# EAGLE design sht31 (EAGLE 7.7.0)
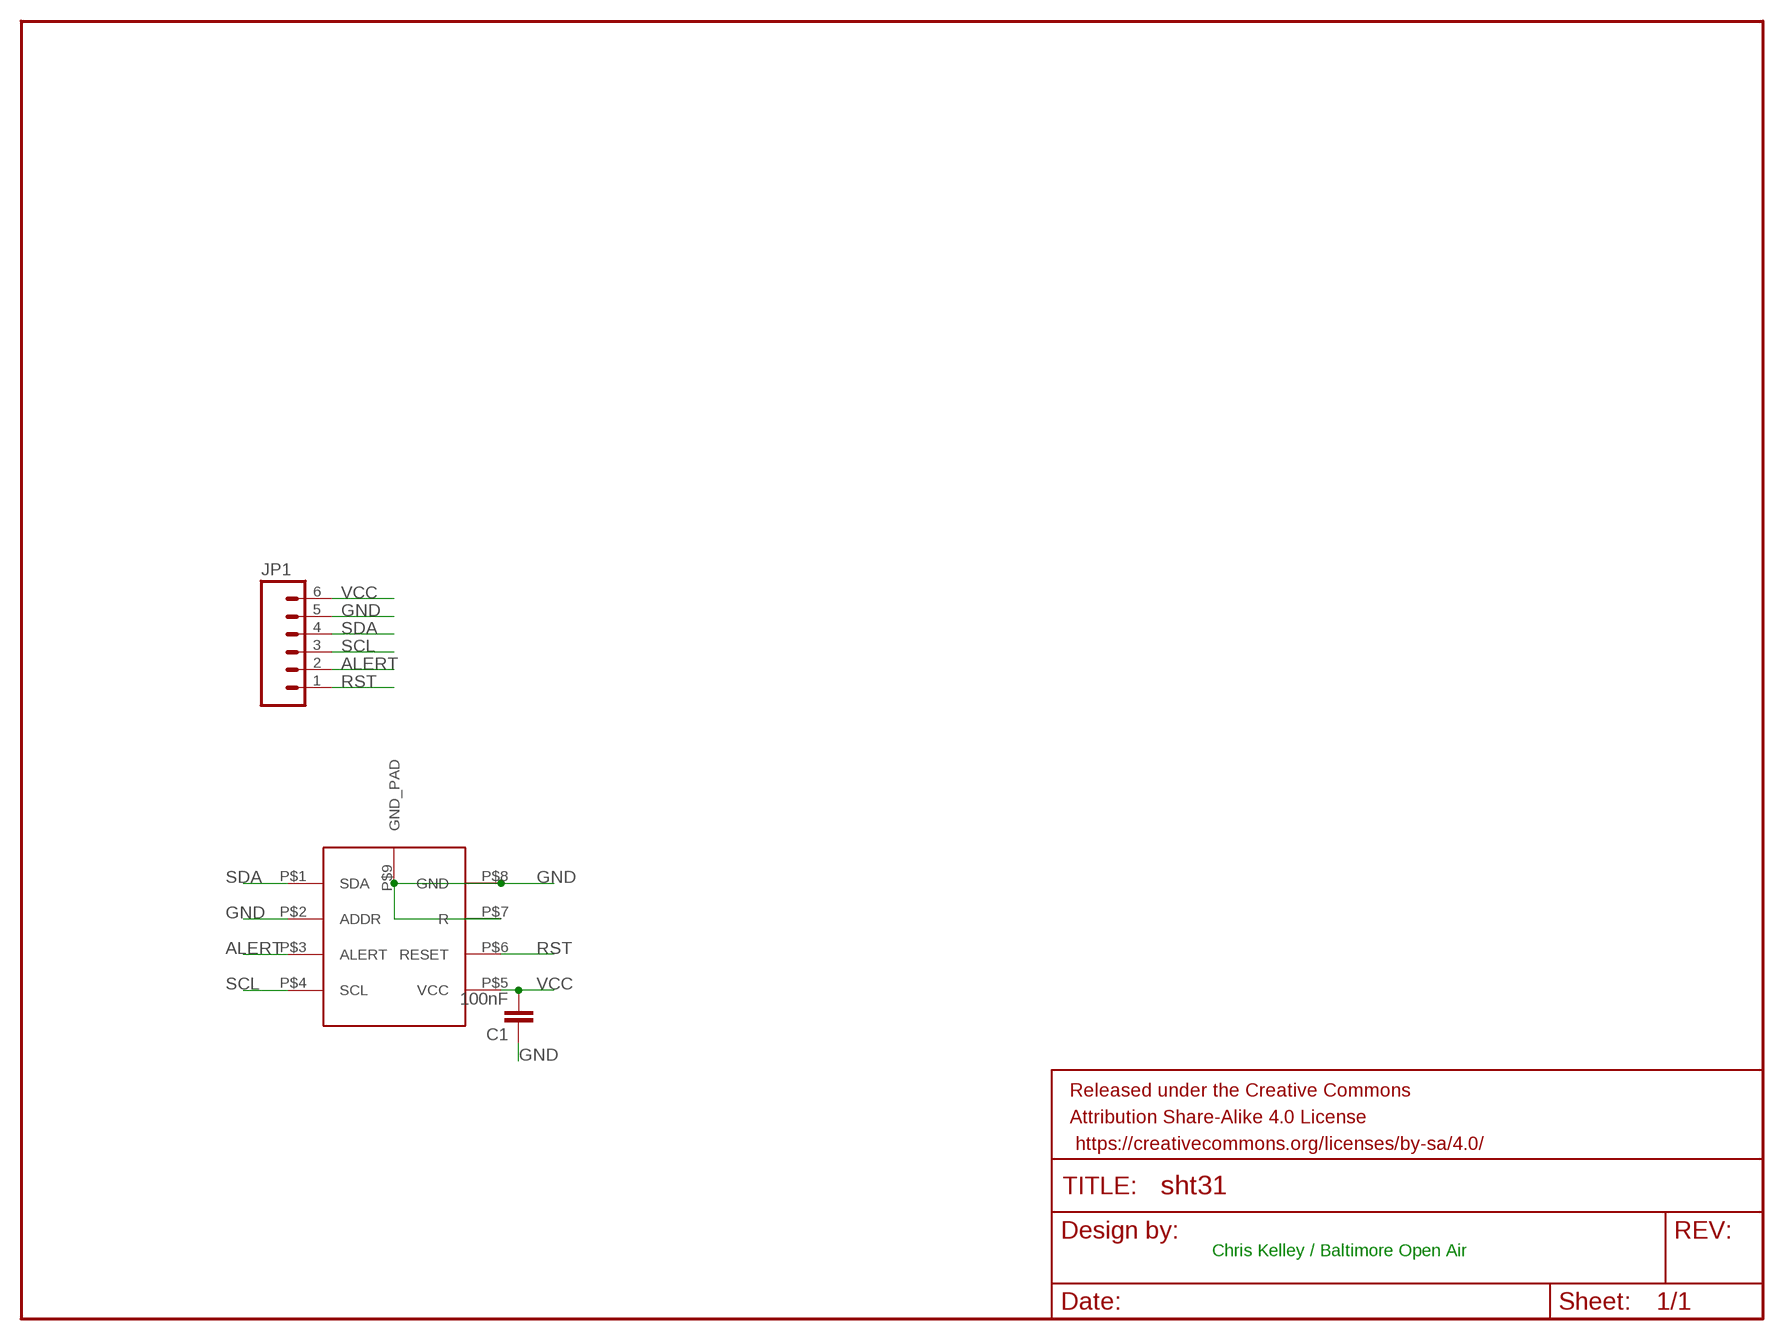
[diagram p0: schematic, sheet 1]

## Parts
C1  100nF  CAP0603-CAP  [0603-CAP]
FRAME1  FRAME-LETTER  [CREATIVE_COMMONS]
JP1  M06SILK_FEMALE_PTH  [1X06]
U$1  SHT31-D  [SHT31-D]

## Nets
ALERT: JP1.2 U$1.P$3(ALERT)
GND: C1.1 JP1.5 U$1.P$2(ADDR) U$1.P$7(R) U$1.P$8(GND) U$1.P$9(GND_PAD)
RST: JP1.1 U$1.P$6(RESET)
SCL: JP1.3 U$1.P$4(SCL)
SDA: JP1.4 U$1.P$1(SDA)
VCC: C1.2 JP1.6 U$1.P$5(VCC)

## Notes on the sheet
- Chris Kelley / Baltimore Open Air

## Library data of the parts
C1 = SparkFun-Passives:CAP: Capacitor Standard 0603 ceramic capacitor, and 0.1" leaded capacitor.
FRAME1 = SparkFun-Aesthetics:FRAME-LETTER: Schematic Frame Standard 8.5x11 US Letter frame
JP1 = SparkFun-Connectors:M06: Header 6 Standard 6-pin 0.1" header. Use with straight break away headers (SKU : PRT-00116), right angle break away headers (PRT-00553), swiss pins (PRT-00743), machine pins (PRT-00117), and female headers (PRT-00115). Molex polarized connector foot print use with SKU : PRT-08094 with associated crimp pins and housings. NOTES ON THE VARIANTS LOCK and LOCK_LONGPADS... This footprint was designed to help hold the alignment of a through-hole component (i.e. 6-pin header) while soldering it into place. You may notice that each hole has been shifted either up or down by 0.005 of an inch from it's more standard position (which is a perfectly straight line). This slight alteration caused the pins (the squares in the middle) to touch the edges of the holes. Because they are alternating, it causes a "brace" to hold the component in place. 0.005 has proven to be the perfect amount of "off-center" position when using our standard breakaway headers. Although looks a little odd when you look at the bare footprint, once you have a header in there, the alteration is very hard to notice. Also,if you push a header all the way into place, it is covered up entirely on the bottom side. This idea of altering the position of holes to aid alignment will be further integrated into the Sparkfun Library for other footprints. It can help hold any component with 3 or more connection pins.; PROD_ID: CONN-08437
U$1 = awqua_eagle_library:SHT31-D

## Board
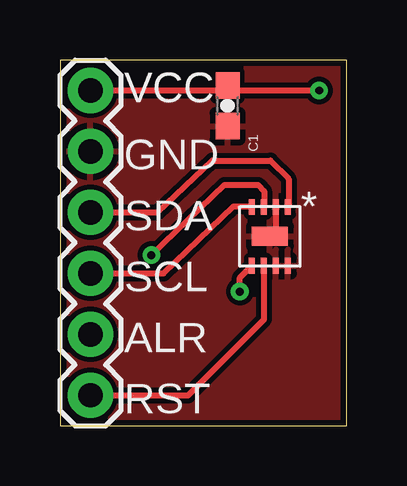
[diagram p1: board, top side]
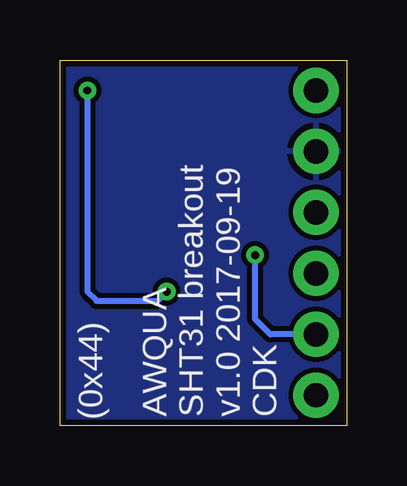
[diagram p2: board, bottom side, seen from below]

Size 11.94 x 15.24 mm. Coordinates in mm from the lower left corner, seen from the top.
Outline: 11.94,0 11.94,15.24 0,15.24 0,0 11.94,0
Copper layers (1*16): Top 0.035mm / dielectric 1.5mm / Bottom 0.035mm
Design rules "default *": minimum track width 6mil, minimum drill 12mil, track to track 8mil, track to pad 8mil, pad to pad 8mil, via to via 8mil, smd to smd 8mil, copper to edge 10mil, drill to drill 8mil, minimum pad ring 10mil, minimum via ring 8mil, stop-mask expansion 4mil, vias tented up to drill 13mil, thermal gap 10mil

### Footprints (pad centres in the part's own frame; a part is rotated, then mirrored left to right if it is on the bottom)
0603-CAP = smd 1.1 x 1: 1 -0.85,0; 2 0.85,0
1X06 = drill 1.016 pad 1.88: 1 0,0; 2 2.54,0; 3 5.08,0; 4 7.62,0; 5 10.16,0; 6 12.7,0
SHT31-D = smd 0.65 x 0.25: P$1 0.025,2; P$2 0.025,1.5; P$3 0.025,1; P$4 0.025,0.5; P$5 2.475,0.5; P$6 2.475,1; P$7 2.475,1.5; P$8 2.475,2 | smd 0.8 x 1.5: P$9 1.25,1.25

### Placement (x,y rotation side)
C1  6.99,13.34 90 top
FRAME1  8.89,-15.75 0 top  (outside the outline)
JP1  1.27,1.27 90 top
U$1  7.49,9.14 270 top

### Tracks (layer width: path | path; a pad name or v marks a point on that pad's centre or on a via)
ALERT  (via drill 0.33)
  Top 0.254: v3.81,7.11 6.86,10.03 8.26,10.03 8.51,9.78 8.51,9.13 U$1.P$3
  Bottom 0.254: v3.81,7.11 3.81,4.45 3.17,3.81 JP1.2
GND
  Top 0.254: U$1.P$2 8.99,8.14 U$1.P$9
  pour Top: -2.67,30.73 30.1,30.73 29.84,-3.43 -2.92,-3.43
  pour Bottom: -2.79,30.86 29.97,30.86 29.72,-3.3 -3.05,-3.3
RST
  Top 0.254: JP1.1 5.33,1.27 8.51,4.45 8.51,6.65 U$1.P$6
SCL
  Top 0.254: JP1.3 4.32,6.35 7.24,9.14 7.97,9.14 U$1.P$4
SDA
  Top 0.254: JP1.4 4.06,8.89 6.35,11.05 8.76,11.05 9.53,10.29 9.53,9.15 U$1.P$1
VCC  (via drill 0.33)
  Top 0.254: JP1.6 6.57,13.97 C1.2 7.28,14.19 7.37,13.97 v10.79,13.97 | v7.49,5.59 7.49,6.17 U$1.P$5
  Bottom 0.254: v10.79,13.97 10.79,5.59 10.41,5.21 7.87,5.21 v7.49,5.59

### Text on the board
tPlace: VCC | GND | * | SDA | SCL | ALR | RST
bPlace: AWQUA / SHT31 breakout / v1.0 2017-09-19 / CDK | (0x44)
tNames: Chris Kelley / Baltimore Open Air